# EAGLE design SensorStick_IMUedits_HeaderPins_jesus (EAGLE 9.6.2)
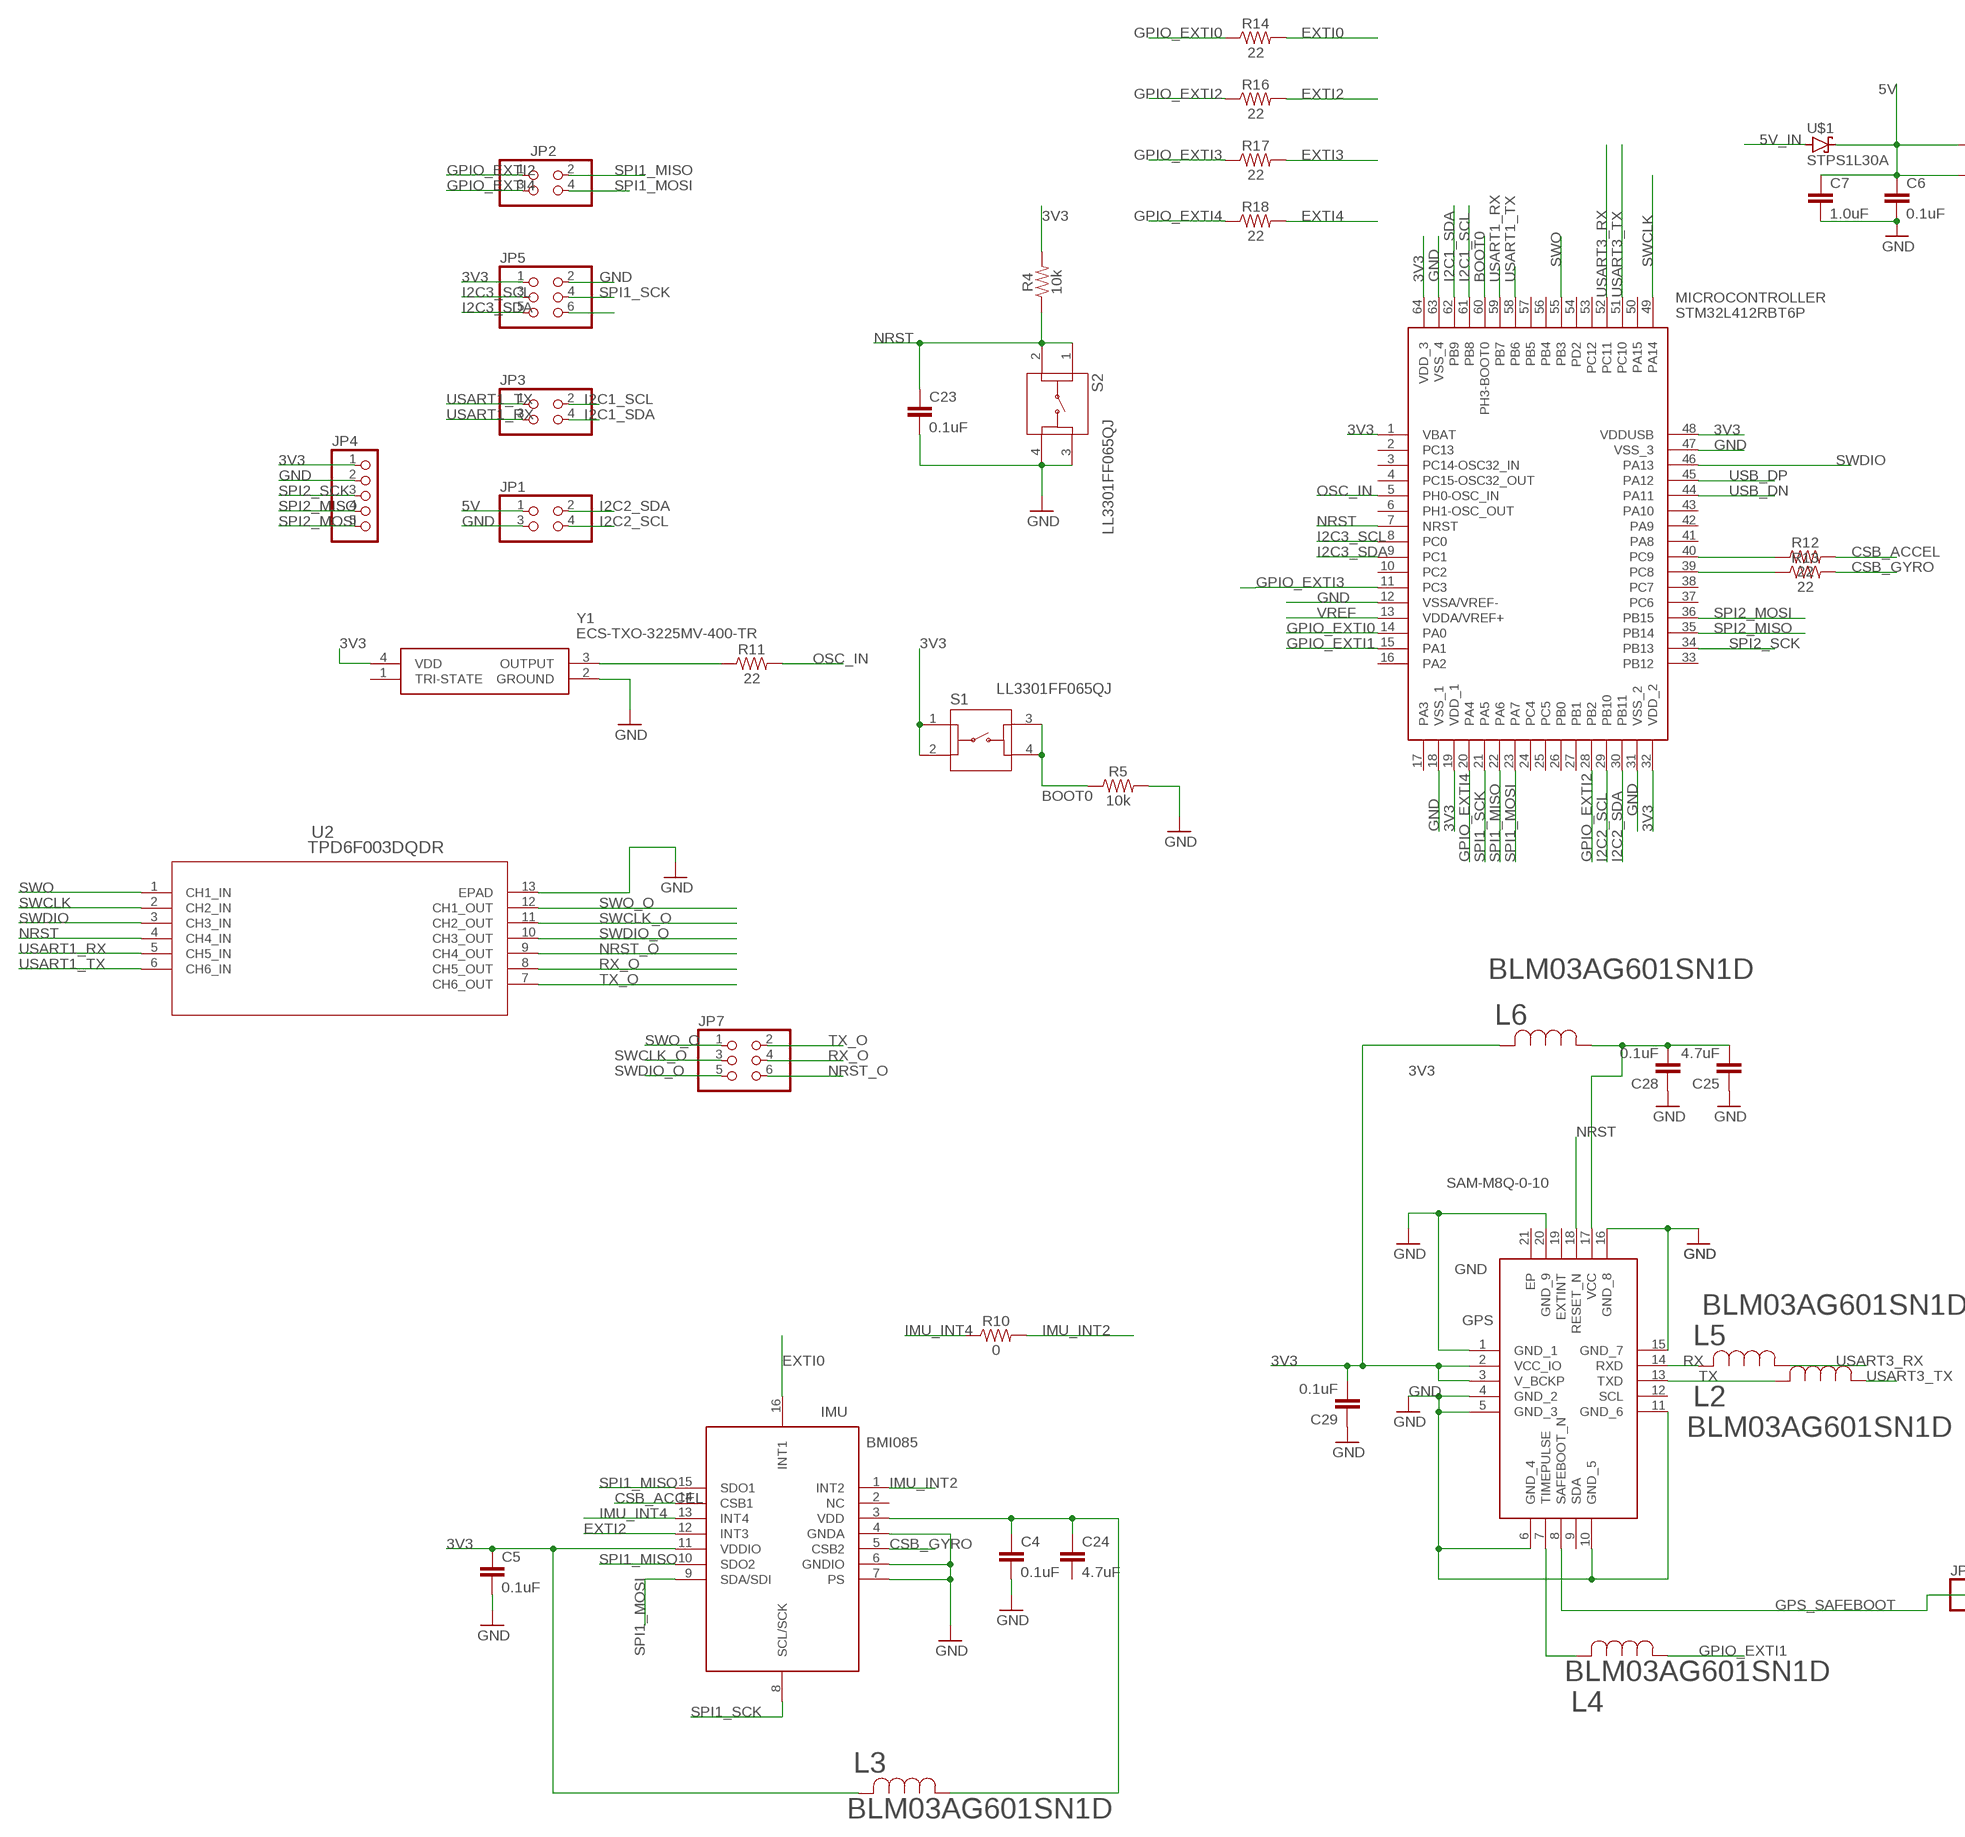
[diagram p0: schematic, sheet 1, part 1 of 2]
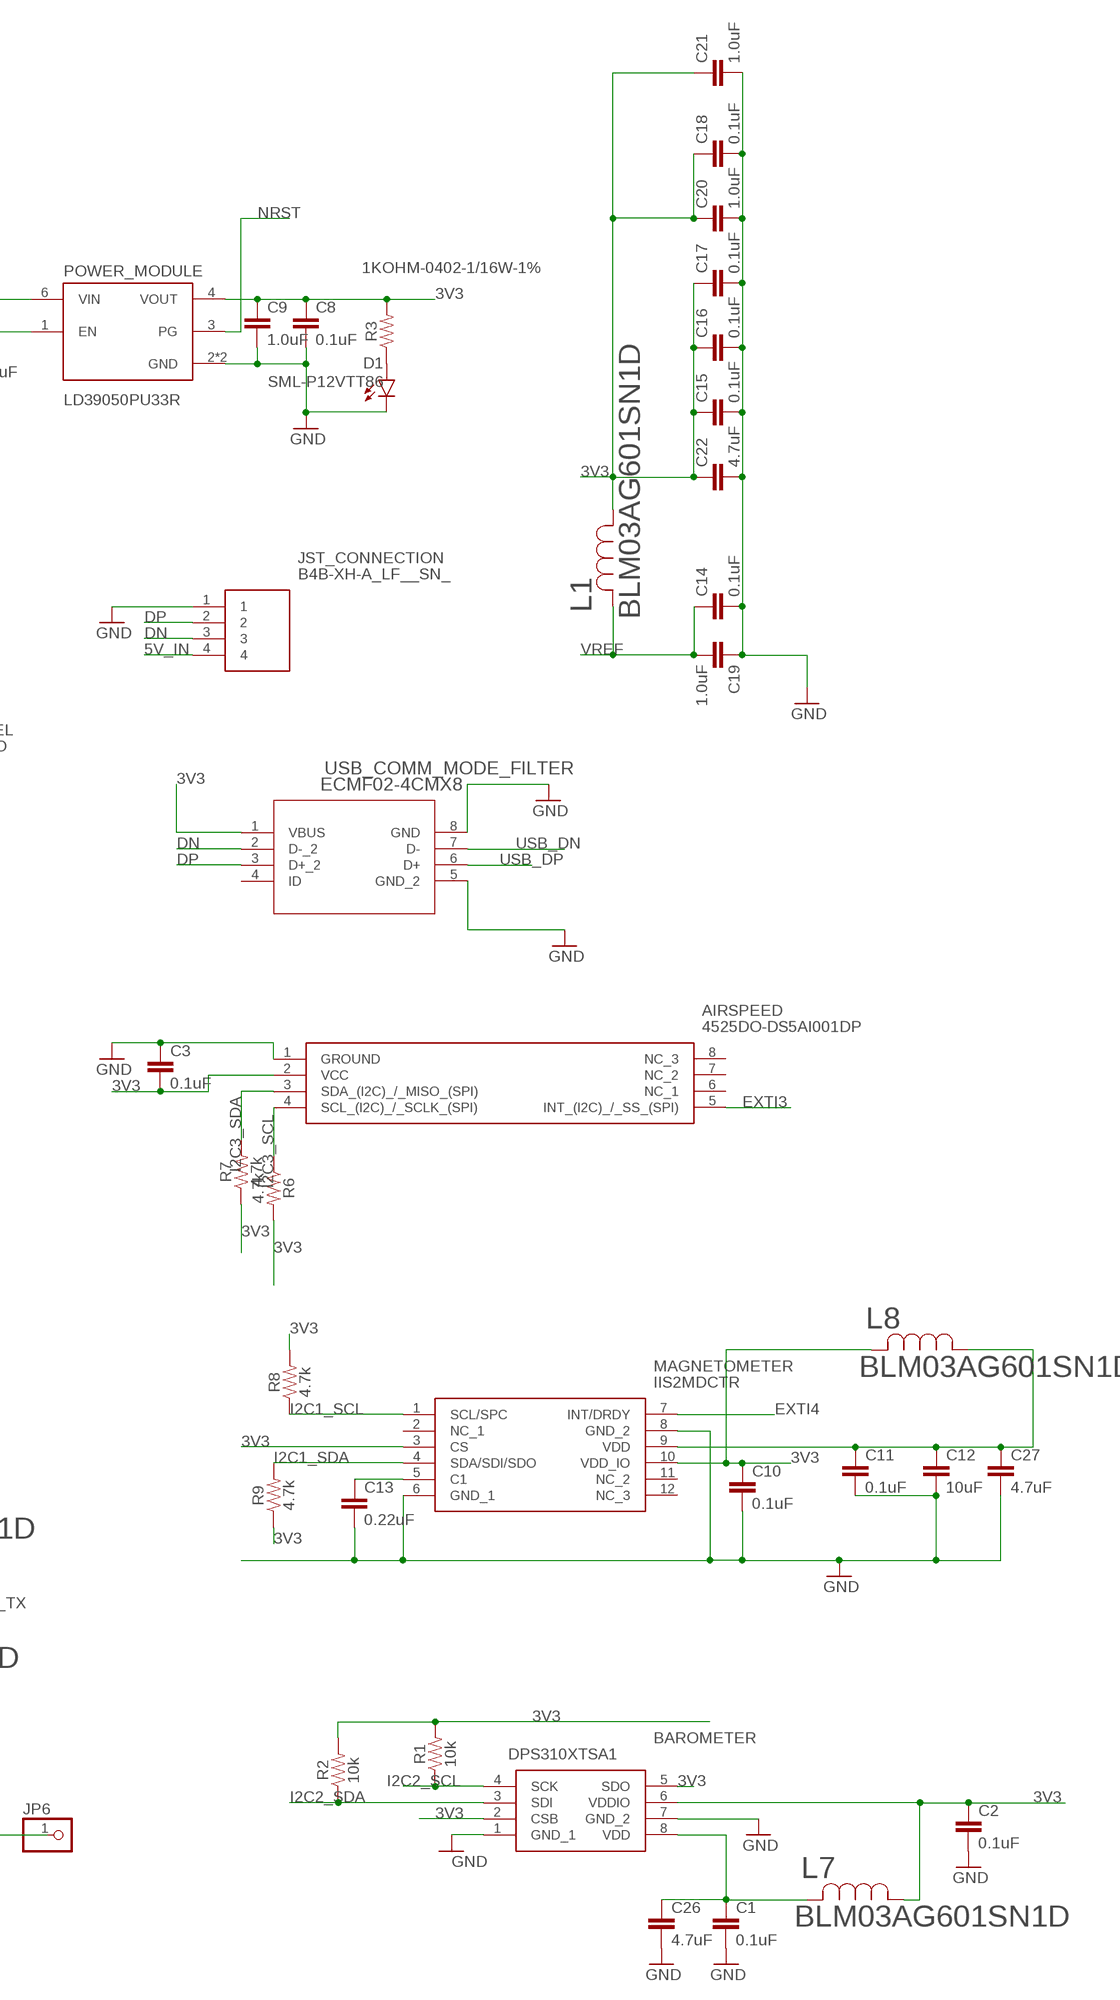
[diagram p1: schematic, sheet 1, part 2 of 2]

## Parts
AIRSPEED  4525DO-DS5AI001DP  [4525DO-DS...P]
BAROMETER  DPS310XTSA1  [DPS310XTSA1]
C1  0.1uF  0.1UF-0402-6.3V-10%-X7R  [0402]
C2  0.1uF  0.1UF-0402-6.3V-10%-X7R  [0402]
C3  0.1uF  0.1UF-0402-6.3V-10%-X7R  [0402]
C4  0.1uF  0.1UF-0402-6.3V-10%-X7R  [0402]
C5  0.1uF  0.1UF-0402-6.3V-10%-X7R  [0402]
C6  0.1uF  0.1UF-0402-6.3V-10%-X7R  [0402]
C7  1.0uF  1.0UF-0402-16V-10%  [0402]
C8  0.1uF  0.1UF-0402-6.3V-10%-X7R  [0402]
C9  1.0uF  1.0UF-0402-16V-10%  [0402]
C10  0.1uF  0.1UF-0402-6.3V-10%-X7R  [0402]
C11  0.1uF  0.1UF-0402-6.3V-10%-X7R  [0402]
C12  10uF  10UF-0603-6.3V-20%  [0603]
C13  0.22uF  0.22UF-0603-25V-10%  [0603]
C14  0.1uF  0.1UF-0603-25V-5%  [0603]
C15  0.1uF  0.1UF-0603-25V-5%  [0603]
C16  0.1uF  0.1UF-0603-25V-5%  [0603]
C17  0.1uF  0.1UF-0603-25V-5%  [0603]
C18  0.1uF  0.1UF-0603-25V-5%  [0603]
C19  1.0uF  1.0UF-0805-25V-10%  [0805]
C20  1.0uF  1.0UF-0805-25V-10%  [0805]
C21  1.0uF  1.0UF-0805-25V-10%  [0805]
C22  4.7uF  4.7UF0603  [0603]
C23  0.1uF  0.1UF-0603-25V-5%  [0603]
C24  4.7uF  4.7UF0603  [0603]
C25  4.7uF  4.7UF0603  [0603]
C26  4.7uF  4.7UF0603  [0603]
C27  4.7uF  4.7UF0603  [0603]
C28  0.1uF  0.1UF-0402-16V-10%  [0402]
C29  0.1uF  0.1UF-0402-16V-10%  [0402]
D1  SML-P12VTT86  [LED_SML-P11UTT86R]
GPS  SAM-M8Q-0-10  [SAMM8Q010]
IMU  BMI085  [BMI085]
JP1  PINHD-2X2  [2X02]
JP2  PINHD-2X2  [2X02]
JP3  PINHD-2X2  [2X02]
JP4  PINHD-1X5  [1X05]
JP5  PINHD-2X3  [2X03]
JP6  PINHD-1X1  [1X01]
JP7  PINHD-2X3  [2X03]
JST_CONNECTION  B4B-XH-A_LF__SN_  [B4BXHALFSN]
L1  BLM03AG601SN1D  [IND_BLM03_0201_MUR]
L2  BLM03AG601SN1D  [IND_BLM03_0201_MUR]
L3  BLM03AG601SN1D  [IND_BLM03_0201_MUR]
L4  BLM03AG601SN1D  [IND_BLM03_0201_MUR]
L5  BLM03AG601SN1D  [IND_BLM03_0201_MUR]
L6  BLM03AG601SN1D  [IND_BLM03_0201_MUR]
L7  BLM03AG601SN1D  [IND_BLM03_0201_MUR]
L8  BLM03AG601SN1D  [IND_BLM03_0201_MUR]
MAGNETOMETER  IIS2MDCTR  [IIS2MDCTR]
MICROCONTROLLER  STM32L412RBT6P  [QFP50P1200X1200X160-64N]
POWER_MODULE  LD39050PU33R  [SON95P300X300X100-7N]
R1  10k  10KOHM-0402-1/16W-1%  [0402]
R2  10k  10KOHM-0402-1/16W-1%  [0402]
R3  1KOHM-0402-1/16W-1%  [0402]
R4  10k  10KOHM-0603-1/10W-1%  [0603]
R5  10k  10KOHM-0603-1/10W-1%  [0603]
R6  4.7k  4.7KOHM-0603-1/10W-1%  [0603]
R7  4.7k  4.7KOHM-0603-1/10W-1%  [0603]
R8  4.7k  4.7KOHM-0603-1/10W-1%  [0603]
R9  4.7k  4.7KOHM-0603-1/10W-1%  [0603]
R10  0  0OHM-0603-1/10W-5%  [0603]
R11  22  22OHM-0402-1/10W-1%  [0402]
R12  22  22OHM-0402-1/10W-1%  [0402]
R13  22  22OHM-0402-1/10W-1%  [0402]
R14  22  22OHM-0402-1/10W-1%  [0402]
R16  22  22OHM-0402-1/10W-1%  [0402]
R17  22  22OHM-0402-1/10W-1%  [0402]
R18  22  22OHM-0402-1/10W-1%  [0402]
S1  LL3301FF065QJ  [LL3301FF065QJ]
S2  LL3301FF065QJ  [LL3301FF065QJ]
U2  TPD6F003DQDR  [DQD12_2X0P4]
U$1  STPS1L30A  [DIOM5226X223N]
USB_COMM_MODE_FILTER  ECMF02-4CMX8  [MICRO_QFN-8L_STM]
Y1  ECS-TXO-3225MV-400-TR  [ECSTXO3225MV400TR]

## Nets
3V3: AIRSPEED.2(VCC) BAROMETER.2(CSB) BAROMETER.5(SDO) BAROMETER.6(VDDIO) C2.1 C3.2 C5.1 C8.1 C9.1 C10.1 C15.1 C16.1 C17.1 C18.1 C20.1 C21.1 C22.1 C29.2 GPS.2(VCC_IO) GPS.3(V_BCKP) IMU.11(VDDIO) JP4.1 JP5.1 L1.1 L3.2 L6.2 L7.1 L8.2 MAGNETOMETER.3(CS) MAGNETOMETER.10(VDD_IO) MICROCONTROLLER.1(VBAT) MICROCONTROLLER.19(VDD_1) MICROCONTROLLER.32(VDD_2) MICROCONTROLLER.48(VDDUSB) MICROCONTROLLER.64(VDD_3) POWER_MODULE.4(VOUT) R1.2 R2.2 R3.2 R4.2 R6.2 R7.1 R8.2 R9.1 S1.1 S1.2 USB_COMM_MODE_FILTER.1(VBUS) Y1.4(VDD)
5V: C6.1 C7.1 JP1.1 POWER_MODULE.1(EN) POWER_MODULE.6(VIN) U$1.1(C)
5V_IN: JST_CONNECTION.4 U$1.2(A)
BOOT0: MICROCONTROLLER.60(PH3-BOOT0) R5.1 S1.3 S1.4
CSB_ACCEL: IMU.14(CSB1) R12.2
CSB_GYRO: IMU.5(CSB2) R13.2
DN: JST_CONNECTION.3 USB_COMM_MODE_FILTER.2(D-_2)
DP: JST_CONNECTION.2 USB_COMM_MODE_FILTER.3(D+_2)
EXTI0: IMU.16(INT1) R14.2
EXTI2: IMU.12(INT3) R16.2
EXTI3: AIRSPEED.5(INT_(I2C)_/_SS_(SPI)) R17.2
EXTI4: MAGNETOMETER.7(INT/DRDY) R18.2
GND: AIRSPEED.1(GROUND) BAROMETER.1(GND_1) BAROMETER.7(GND_2) C1.2 C2.2 C3.1 C4.2 C5.2 C6.2 C7.2 C8.2 C9.2 C10.2 C11.2 C12.2 C13.2 C14.2 C15.2 C16.2 C17.2 C18.2 C19.1 C20.2 C21.2 C22.2 C23.2 C25.1 C26.2 C27.2 C28.1 C29.1 D1.C GPS.1(GND_1) GPS.4(GND_2) GPS.5(GND_3) GPS.6(GND_4) GPS.10(GND_5) GPS.11(GND_6) GPS.15(GND_7) GPS.16(GND_8) GPS.20(GND_9) IMU.4(GNDA) IMU.6(GNDIO) IMU.7(PS) JP1.3 JP4.2 JP5.2 JST_CONNECTION.1 MAGNETOMETER.6(GND_1) MAGNETOMETER.8(GND_2) MICROCONTROLLER.12(VSSA/VREF-) MICROCONTROLLER.18(VSS_1) MICROCONTROLLER.31(VSS_2) MICROCONTROLLER.47(VSS_3) MICROCONTROLLER.63(VSS_4) POWER_MODULE.2(GND) POWER_MODULE.7(GND) R5.2 S2.3 S2.4 U2.13(EPAD) USB_COMM_MODE_FILTER.5(GND_2) USB_COMM_MODE_FILTER.8(GND) Y1.2(GROUND)
GPIO_EXTI0: MICROCONTROLLER.14(PA0) R14.1
GPIO_EXTI1: L4.1 MICROCONTROLLER.15(PA1)
GPIO_EXTI2: JP2.1 MICROCONTROLLER.28(PB2) R16.1
GPIO_EXTI3: MICROCONTROLLER.11(PC3) R17.1
GPIO_EXTI4: JP2.3 MICROCONTROLLER.20(PA4) R18.1
GPS_SAFEBOOT: GPS.8(SAFEBOOT_N) JP6.1
I2C1_SCL: JP3.2 MAGNETOMETER.1(SCL/SPC) MICROCONTROLLER.61(PB8) R8.1
I2C1_SDA: JP3.4 MAGNETOMETER.4(SDA/SDI/SDO) MICROCONTROLLER.62(PB9) R9.2
I2C2_SCL: BAROMETER.4(SCK) JP1.4 MICROCONTROLLER.29(PB10) R1.1
I2C2_SDA: BAROMETER.3(SDI) JP1.2 MICROCONTROLLER.30(PB11) R2.1
I2C3_SCL: AIRSPEED.4(SCL_(I2C)_/_SCLK_(SPI)) JP5.3 MICROCONTROLLER.8(PC0) R6.1
I2C3_SDA: AIRSPEED.3(SDA_(I2C)_/_MISO_(SPI)) JP5.5 MICROCONTROLLER.9(PC1) R7.2
IMU_INT2: IMU.1(INT2) R10.2
IMU_INT4: IMU.13(INT4) R10.1
N$1: R11.1 Y1.3(OUTPUT)
N$2: GPS.7(TIMEPULSE) L4.2
N$3: MICROCONTROLLER.40(PC9) R12.1
N$4: MICROCONTROLLER.39(PC8) R13.1
N$5: D1.A R3.1
N$6: BAROMETER.8(VDD) C1.1 C26.1 L7.2
N$7: C13.1 MAGNETOMETER.5(C1)
N$8: C4.1 C24.1 IMU.3(VDD) L3.1
N$9: C25.2 C28.2 GPS.17(VCC) L6.1
N$10: C11.1 C12.1 C27.1 L8.1 MAGNETOMETER.9(VDD)
N$11: JP5.6
NRST: C23.1 GPS.18(RESET_N) MICROCONTROLLER.7(NRST) POWER_MODULE.3(PG) R4.1 S2.1 S2.2 U2.4(CH4_IN)
NRST_O: JP7.6 U2.9(CH4_OUT)
OSC_IN: MICROCONTROLLER.5(PH0-OSC_IN) R11.2
RX: GPS.14(RXD) L5.2
RX_O: JP7.4 U2.8(CH5_OUT)
SPI1_MISO: IMU.10(SDO2) IMU.15(SDO1) JP2.2 MICROCONTROLLER.22(PA6)
SPI1_MOSI: IMU.9(SDA/SDI) JP2.4 MICROCONTROLLER.23(PA7)
SPI1_SCK: IMU.8(SCL/SCK) JP5.4 MICROCONTROLLER.21(PA5)
SPI2_MISO: JP4.4 MICROCONTROLLER.35(PB14)
SPI2_MOSI: JP4.5 MICROCONTROLLER.36(PB15)
SPI2_SCK: JP4.3 MICROCONTROLLER.34(PB13)
SWCLK: MICROCONTROLLER.49(PA14) U2.2(CH2_IN)
SWCLK_O: JP7.3 U2.11(CH2_OUT)
SWDIO: MICROCONTROLLER.46(PA13) U2.3(CH3_IN)
SWDIO_O: JP7.5 U2.10(CH3_OUT)
SWO: MICROCONTROLLER.55(PB3) U2.1(CH1_IN)
SWO_O: JP7.1 U2.12(CH1_OUT)
TX: GPS.13(TXD) L2.2
TX_O: JP7.2 U2.7(CH6_OUT)
USART1_RX: JP3.3 MICROCONTROLLER.59(PB7) U2.5(CH5_IN)
USART1_TX: JP3.1 MICROCONTROLLER.58(PB6) U2.6(CH6_IN)
USART3_RX: L5.1 MICROCONTROLLER.52(PC11)
USART3_TX: L2.1 MICROCONTROLLER.51(PC10)
USB_DN: MICROCONTROLLER.44(PA11) USB_COMM_MODE_FILTER.7(D-)
USB_DP: MICROCONTROLLER.45(PA12) USB_COMM_MODE_FILTER.6(D+)
VREF: C14.1 C19.2 L1.2 MICROCONTROLLER.13(VDDA/VREF+)
Unconnected: AIRSPEED.6(NC_1) AIRSPEED.7(NC_2) AIRSPEED.8(NC_3) C24.2 GPS.9(SDA) GPS.12(SCL) GPS.19(EXTINT) GPS.21(EP) IMU.2(NC) MAGNETOMETER.2(NC_1) MAGNETOMETER.11(NC_2) MAGNETOMETER.12(NC_3) MICROCONTROLLER.2(PC13) MICROCONTROLLER.3(PC14-OSC32_IN) MICROCONTROLLER.4(PC15-OSC32_OUT) MICROCONTROLLER.6(PH1-OSC_OUT) MICROCONTROLLER.10(PC2) MICROCONTROLLER.16(PA2) MICROCONTROLLER.17(PA3) MICROCONTROLLER.24(PC4) MICROCONTROLLER.25(PC5) MICROCONTROLLER.26(PB0) MICROCONTROLLER.27(PB1) MICROCONTROLLER.33(PB12) MICROCONTROLLER.37(PC6) MICROCONTROLLER.38(PC7) MICROCONTROLLER.41(PA8) MICROCONTROLLER.42(PA9) MICROCONTROLLER.43(PA10) MICROCONTROLLER.50(PA15) MICROCONTROLLER.53(PC12) MICROCONTROLLER.54(PD2) MICROCONTROLLER.56(PB4) MICROCONTROLLER.57(PB5) USB_COMM_MODE_FILTER.4(ID) Y1.1(TRI-STATE)

## Library data of the parts
AIRSPEED = 4525DO-DS5AI001DP:4525DO-DS5AI001DP: Differential Pressure Sensor 1PSI Dual Barbs Source: Datasheet <http://www.te.com/commerce/DocumentDelivery/DDEController?Action=srchrtrv&DocNm=MS4525DO&DocType=DS&DocLang=English>; ARROW_PART_NUMBER: 4525DO-DS5AI001DP; ARROW_PRICE-STOCK: https://www.arrow.com/en/products/4525do-ds5ai001dp/te-connectivity; DESCRIPTION: Differential Pressure Sensor 1PSI Dual Barbs; HEIGHT: mm; MANUFACTURER_NAME: TE Connectivity; MANUFACTURER_PART_NUMBER: 4525DO-DS5AI001DP; MOUSER_PART_NUMBER: 824-4525DODS5AI001DP; MOUSER_PRICE-STOCK: https://www.mouser.co.uk/ProductDetail/Measurement-Specialties/4525DO-DS5AI001DP?qs=oFx6pF86PmDUpUCTX7loEA%3D%3D
BAROMETER = DPS310XTSA1:DPS310XTSA1: INFINEON - DPS310XTSA1 - DIGITAL PRESSURE SENSOR, 1200HPA, VLGA-8 Source: Datasheet <https://www.infineon.com/dgdl/Infineon-DPS310-DS-v01_00-EN.pdf?fileId=5546d462576f34750157750826c42242>; ARROW_PART_NUMBER: DPS310XTSA1; ARROW_PRICE-STOCK: https://www.arrow.com/en/products/dps310xtsa1/infineon-technologies-ag?region=nac; DESCRIPTION: INFINEON - DPS310XTSA1 - DIGITAL PRESSURE SENSOR, 1200HPA, VLGA-8; HEIGHT: 1.01mm; MANUFACTURER_NAME: Infineon; MANUFACTURER_PART_NUMBER: DPS310XTSA1; MOUSER_PART_NUMBER: 726-DPS310XTSA1; MOUSER_PRICE-STOCK: https://www.mouser.co.uk/ProductDetail/Infineon-Technologies/DPS310XTSA1?qs=uuTTuBTXn66Ynca8WHwycg%3D%3D
C1 C2 C4-C6 C8 C10 C11 = SparkFun-Capacitors:0.1UF: 0.1µF ceramic capacitors A capacitor is a passive two-terminal electrical component used to store electrical energy temporarily in an electric field.; PROD_ID: CAP-14993
C3 = SparkFun-Capacitors:0.1UF: 0.1µF ceramic capacitors A capacitor is a passive two-terminal electrical component used to store electrical energy temporarily in an electric field.; PROD_ID: CAP-14993; SPICEPREFIX: C
C7 C9 = SparkFun-Capacitors:1.0UF: 1µF ceramic capacitors A capacitor is a passive two-terminal electrical component used to store electrical energy temporarily in an electric field.; PROD_ID: CAP-12417
C12 = SparkFun-Capacitors:10UF: 10.0µF ceramic capacitors A capacitor is a passive two-terminal electrical component used to store electrical energy temporarily in an electric field.; PROD_ID: CAP-11015
C13 = SparkFun-Capacitors:0.22UF: 0.22µF ceramic capacitors A capacitor is a passive two-terminal electrical component used to store electrical energy temporarily in an electric field.; PROD_ID: CAP-07822
C14-C18 C23 = SparkFun-Capacitors:0.1UF: 0.1µF ceramic capacitors A capacitor is a passive two-terminal electrical component used to store electrical energy temporarily in an electric field.; PROD_ID: CAP-08604
C19-C21 = SparkFun-Capacitors:1.0UF: 1µF ceramic capacitors A capacitor is a passive two-terminal electrical component used to store electrical energy temporarily in an electric field.; PROD_ID: CAP-08064
C22 C24-C27 = SparkFun-Capacitors:4.7UF: 4.7µF ceramic capacitors A capacitor is a passive two-terminal electrical component used to store electrical energy temporarily in an electric field.; PROD_ID: CAP-08280
C28 C29 = SparkFun-Capacitors:0.1UF: 0.1µF ceramic capacitors A capacitor is a passive two-terminal electrical component used to store electrical energy temporarily in an electric field.; PROD_ID: CAP-12416
D1 = ce-capstone:SML-P12VTT86: SML-P1 Series Red 0402 Clear 60 mcd 2 V Surface Mount PICOLED LED; AVAILABILITY: Unavailable; DESCRIPTION: Red 630nm LED Indication - Discrete 2V 0402 _1006 Metric_; MF: Rohm; MP: SML-P12VTT86; PACKAGE: 0402 Rohm; PRICE: None
GPS = SAM-M8Q-0-10:SAM-M8Q-0-10: GNSS antenna module Source: Datasheet <https://www.u-blox.com/sites/default/files/SAM-M8Q_DataSheet_(UBX-16012619).pdf>; DESCRIPTION: GNSS antenna module; HEIGHT: 3mm; MANUFACTURER_NAME: U-Blox; MANUFACTURER_PART_NUMBER: SAM-M8Q-0-10; MOUSER_PART_NUMBER: N/A; MOUSER_PRICE-STOCK: https://www.mouser.co.uk/ProductDetail/u-blox/SAM-M8Q-0-10?qs=KUoIvG%2F9IlYKGQbFkOKljQ%3D%3D
IMU = BMI085:BMI085: IMUs - Inertial Measurement Units High-performance IMU BMI085 for virtual and augmented reality applications Source: Datasheet <https://ae-bst.resource.bosch.com/media/_tech/media/datasheets/BST-BMI085-DS001.pdf>; ARROW_PART_NUMBER: BMI085; ARROW_PRICE-STOCK: https://www.arrow.com/en/products/bmi085/bosch; DESCRIPTION: IMUs - Inertial Measurement Units High-performance IMU BMI085 for virtual and augmented reality applications; HEIGHT: 1mm; MANUFACTURER_NAME: Bosch Sensortec; MANUFACTURER_PART_NUMBER: BMI085; MOUSER_PART_NUMBER: 262-BMI085; MOUSER_PRICE-STOCK: https://www.mouser.co.uk/ProductDetail/Bosch-Sensortec/BMI085?qs=y6ZabgHbY%252ByGCM8LfWZyqA%3D%3D
JP1-JP3 = pinhead:PINHD-2X2: PIN HEADER
JP4 = pinhead:PINHD-1X5: PIN HEADER
JP5 JP7 = pinhead:PINHD-2X3: PIN HEADER
JP6 = pinhead:PINHD-1X1: PIN HEADER
JST_CONNECTION = B4B-XH-A_LF__SN_:B4B-XH-A_LF__SN_: CONN HEADER VERT 4POS 2.5MM Source: Datasheet <https://datasheet.lcsc.com/szlcsc/JST-Sales-America-B4B-XH-A-LF-SN_C144395.pdf>; ARROW_PART_NUMBER: B4B-XH-A(LF)(SN); ARROW_PRICE-STOCK: https://www.arrow.com/en/products/b4b-xh-a-lf-sn/jst-manufacturing?region=europe; DESCRIPTION: CONN HEADER VERT 4POS 2.5MM; HEIGHT: 7mm; MANUFACTURER_NAME: JST (JAPAN SOLDERLESS TERMINALS); MANUFACTURER_PART_NUMBER: B4B-XH-A(LF)(SN)
L1-L8 = BLM03AG601SN1D:BLM03AG601SN1D; COPYRIGHT: Copyright (C) 2023 Ultra Librarian. All rights reserved.; DIGI-KEY_PART_NUMBER_1: 490-5164-1-ND; DIGI-KEY_PART_NUMBER_2: 490-5164-2-ND; DIGI-KEY_PART_NUMBER_3: 490-5164-6-ND; MANUFACTURER_PART_NUMBER: BLM03AG601SN1D; MFR_NAME: Murata
MAGNETOMETER = IIS2MDCTR:IIS2MDCTR: STMICROELECTRONICS - IIS2MDCTR - MEMS MODULE, 3-AXIS MAGNETOMETER, LGA-12 Source: Datasheet <https://www.st.com/resource/en/datasheet/iis2mdc.pdf>; ARROW_PART_NUMBER: IIS2MDCTR; ARROW_PRICE-STOCK: https://www.arrow.com/en/products/iis2mdctr/stmicroelectronics; DESCRIPTION: STMICROELECTRONICS - IIS2MDCTR - MEMS MODULE, 3-AXIS MAGNETOMETER, LGA-12; HEIGHT: 0.7mm; MANUFACTURER_NAME: STMicroelectronics; MANUFACTURER_PART_NUMBER: IIS2MDCTR; MOUSER_PART_NUMBER: 511-IIS2MDCTR; MOUSER_PRICE-STOCK: https://www.mouser.co.uk/ProductDetail/STMicroelectronics/IIS2MDCTR?qs=1mbolxNpo8ems1K%2FRdQzXg%3D%3D
MICROCONTROLLER = STM32L412RBT6P:STM32L412RBT6P: ARM Microcontrollers - MCU Source: Datasheet <https://www.st.com/resource/en/datasheet/stm32l412c8.pdf>; DESCRIPTION: ARM Microcontrollers - MCU; HEIGHT: 1.6mm; MANUFACTURER_NAME: STMicroelectronics; MANUFACTURER_PART_NUMBER: STM32L412RBT6P; MOUSER_PART_NUMBER: 511-STM32L412RBT6P; MOUSER_PRICE-STOCK: https://www.mouser.co.uk/ProductDetail/STMicroelectronics/STM32L412RBT6P?qs=l7cgNqFNU1hh%252BU1wOZs5Xg%3D%3D
POWER_MODULE = ce-capstone:LD39050PU33R: LD39050 Series 500 mA 3.3 V Fixed Low Noise LDO Voltage Regulator - DFN-6; AVAILABILITY: Unavailable; DESCRIPTION: Linear Voltage Regulator IC 1 Output 500mA 6-DFN _3x3_; MF: STMicroelectronics; MP: LD39050PU33R; PACKAGE: DFN-6 STMicroelectronics; PRICE: None
R1 R2 = SparkFun-Resistors:10KOHM: 10kΩ resistor A resistor is a passive two-terminal electrical component that implements electrical resistance as a circuit element. Resistors act to reduce current flow, and, at the same time, act to lower voltage levels within circuits. - Wikipedia; PROD_ID: RES-14241
R3 = SparkFun-Resistors:1KOHM: 1kΩ resistor A resistor is a passive two-terminal electrical component that implements electrical resistance as a circuit element. Resistors act to reduce current flow, and, at the same time, act to lower voltage levels within circuits. - Wikipedia; PROD_ID: RES-14342
R4 R5 = SparkFun-Resistors:10KOHM: 10kΩ resistor A resistor is a passive two-terminal electrical component that implements electrical resistance as a circuit element. Resistors act to reduce current flow, and, at the same time, act to lower voltage levels within circuits. - Wikipedia; PROD_ID: RES-00824
R6-R9 = SparkFun-Resistors:4.7KOHM: 4.7kΩ resistor A resistor is a passive two-terminal electrical component that implements electrical resistance as a circuit element. Resistors act to reduce current flow, and, at the same time, act to lower voltage levels within circuits. - Wikipedia; PROD_ID: RES-07857
R10 = SparkFun-Resistors:0OHM: 0Ω resistor A resistor is a passive two-terminal electrical component that implements electrical resistance as a circuit element. Resistors act to reduce current flow, and, at the same time, act to lower voltage levels within circuits. - Wikipedia; PROD_ID: RES-08609
R11-R14 R16-R18 = SparkFun-Resistors:22OHM: 22Ω resistor A resistor is a passive two-terminal electrical component that implements electrical resistance as a circuit element. Resistors act to reduce current flow, and, at the same time, act to lower voltage levels within circuits. - Wikipedia; PROD_ID: RES-12427
S1 S2 = ce-capstone:LL3301FF065QJ: Pushbutton Switches 50mA 12VDC F065 7.0mm J-Lead Source: Datasheet <https://componentsearchengine.com/Datasheets/1/LL3301FF065QJ.pdf>; DESCRIPTION: Pushbutton Switches 50mA 12VDC F065 7.0mm J-Lead; HEIGHT: 7.3mm; MANUFACTURER_NAME: E-Switch; MANUFACTURER_PART_NUMBER: LL3301FF065QJ; MOUSER_PART_NUMBER: 612-LL3301FF065QJ; MOUSER_PRICE-STOCK: https://www.mouser.com/Search/Refine.aspx?Keyword=612-LL3301FF065QJ
U2 = TPD6F003DQDR:TPD6F003DQDR; COPYRIGHT: Copyright (C) 2023 Ultra Librarian. All rights reserved.; DIGI-KEY_PART_NUMBER_1: 296-25802-1-ND; DIGI-KEY_PART_NUMBER_2: 296-25802-2-ND; DIGI-KEY_PART_NUMBER_3: 296-25802-6-ND; DIGI-KEY_PART_NUMBER_4: 2156-TPD6F003DQDR-ND; MANUFACTURER_PART_NUMBER: TPD6F003DQDR; MFR_NAME: Texas Instruments
U$1 = ce-capstone:STPS1L30A
USB_COMM_MODE_FILTER = ECMF02-4CMX8:ECMF02-4CMX8; COPYRIGHT: Copyright (C) 2023 Ultra Librarian. All rights reserved.; DIGI-KEY_PART_NUMBER_1: 497-13420-2-ND; DIGI-KEY_PART_NUMBER_2: 497-13420-1-ND; DIGI-KEY_PART_NUMBER_3: 497-13420-6-ND; MANUFACTURER_PART_NUMBER: ECMF02-4CMX8; MFR_NAME: STMicroelectronics
Y1 = SamacSys_Parts:ECS-TXO-3225MV-400-TR: TCXO Oscillators 40.000 MHZ Multi-Volt +1.7 3.6V HCMOS TCXO +/-2.5 ppm -30 +85 C 3.2x 2.5mm RoHS Source: Datasheet <https://ecsxtal.com/store/pdf/ECS-TXO-3225MV.pdf>; DESCRIPTION: TCXO Oscillators 40.000 MHZ Multi-Volt +1.7 3.6V HCMOS TCXO +/-2.5 ppm -30 +85 C 3.2x 2.5mm RoHS; HEIGHT: 1.2mm; MANUFACTURER_NAME: ECS; MANUFACTURER_PART_NUMBER: ECS-TXO-3225MV-400-TR

## Board
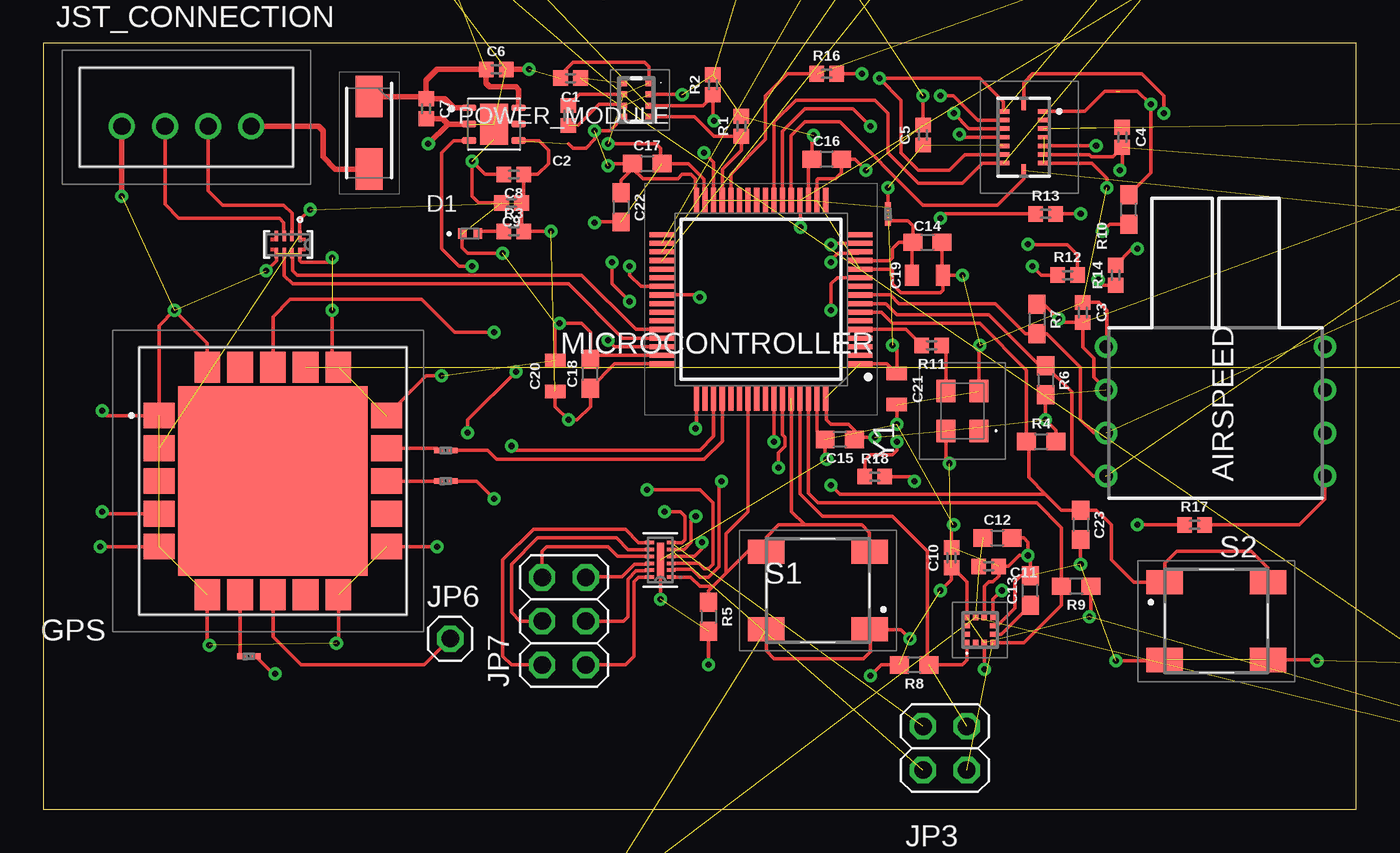
[diagram p2: board, top side]
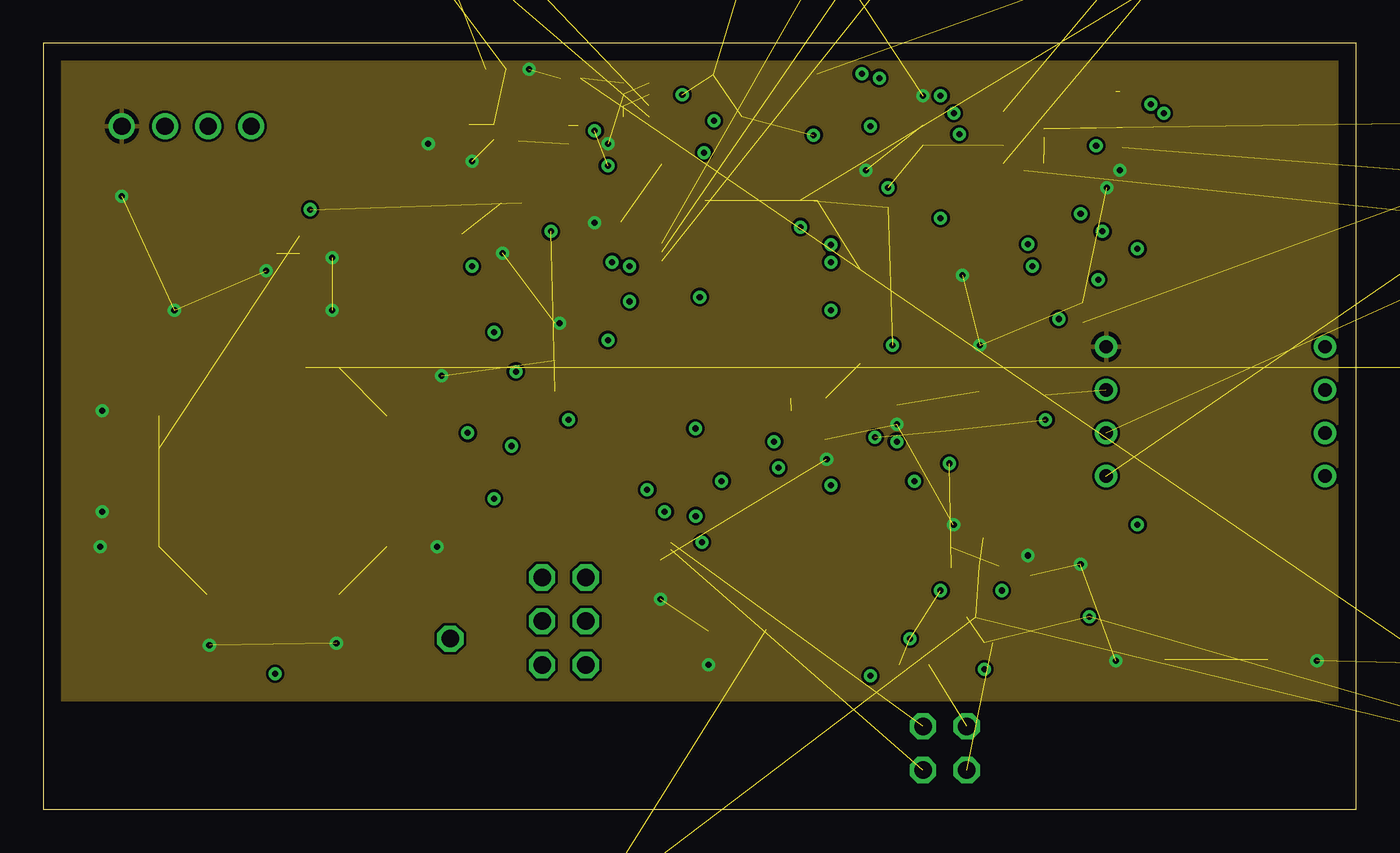
[diagram p3: board, inner layer Route2]
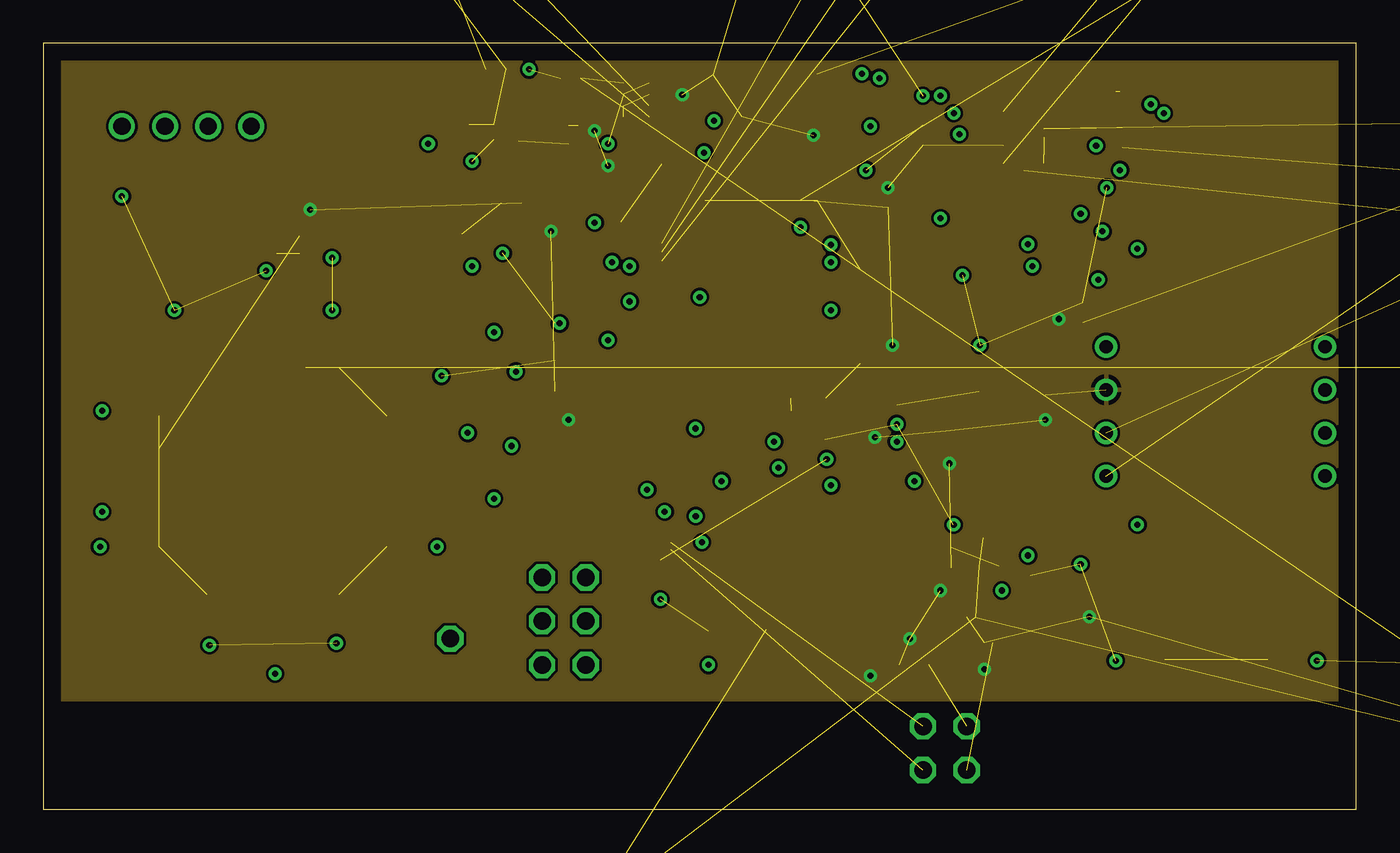
[diagram p4: board, inner layer Route15]
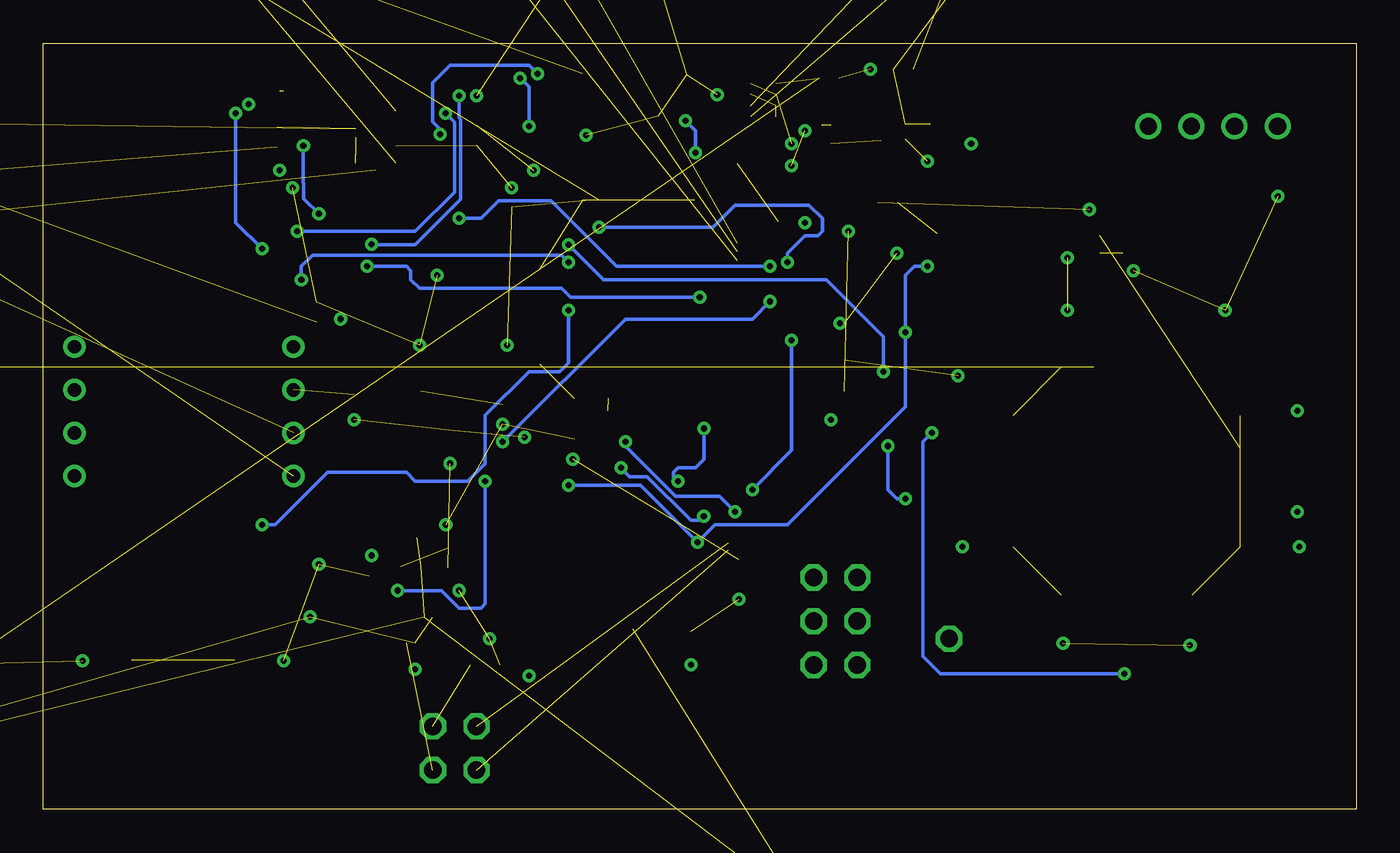
[diagram p5: board, bottom side, seen from below]

Size 76.2 x 44.45 mm. Coordinates in mm from the lower left corner, seen from the top.
Outline: 0,0 76.2,0 76.2,44.45 0,44.45 0,0
Copper layers (1+2*15+16): Top 0.035mm / dielectric 1.5mm / Route2 0.035mm / dielectric 0.15mm / Route15 0.035mm / dielectric 0.2mm / Bottom 0.035mm
Design rules "default *": minimum track width 8mil, minimum drill 0.35mm, track to track 6mil, track to pad 6mil, pad to pad 6mil, via to via 6mil, smd to smd 6mil, copper to edge 40mil, drill to drill 6mil, minimum pad ring 10mil, minimum via ring 8mil, stop-mask expansion 4mil, vias tented up to drill 0mil, thermal gap 10mil

### Footprints (pad centres in the part's own frame; a part is rotated, then mirrored left to right if it is on the bottom)
4525DO-DS...P = drill 0.78 pad 1.28: 1 1.1,-8.3; 2 3.6,-8.3; 3 6.1,-8.3; 4 8.6,-8.3; 5 8.6,4.4; 6 6.1,4.4; 7 3.6,4.4; 8 1.1,4.4
DPS310XTSA1 = smd 0.35 x 0.35: 1 0.975,-0.725; 2 0.325,-0.725; 3 -0.325,-0.725; 4 -0.975,-0.725; 5 -0.975,0.725; 6 -0.325,0.725; 7 0.325,0.725; 8 0.975,0.725
0402 = smd 0.85 x 0.9: 1 -0.58,0; 2 0.58,0
0603 = smd 1.1 x 1: 1 -0.85,0; 2 0.85,0
0805 = smd 0.8 x 1.2: 1 -0.9,0; 2 0.9,0
LED_SML-P11UTT86R = smd 0.5 x 0.6: A 0.45,0; C -0.45,0
SAMM8Q010 = smd 1.8 x 1.5: 1 -6.6,3.8; 2 -6.6,1.9; 3 -6.6,0; 4 -6.6,-1.9; 5 -6.6,-3.8; 11 6.6,-3.8; 12 6.6,-1.9; 13 6.6,0; 14 6.6,1.9; 15 6.6,3.8 | smd 1.5 x 1.8: 6 -3.8,-6.6; 7 -1.9,-6.6; 8 0,-6.6; 9 1.9,-6.6; 10 3.8,-6.6; 16 3.8,6.6; 17 1.9,6.6; 18 0,6.6; 19 -1.9,6.6; 20 -3.8,6.6 | smd 11 x 11: 21 0,0
BMI085 = smd 0.675 x 0.25: 1 1.165,1.5; 2 1.165,1; 3 1.165,0.5; 4 1.165,0; 5 1.165,-0.5; 6 1.165,-1; 7 1.165,-1.5; 9 -1.165,-1.5; 10 -1.165,-1; 11 -1.165,-0.5; 12 -1.165,0; 13 -1.165,0.5; 14 -1.165,1; 15 -1.165,1.5 | smd 0.25 x 0.675: 8 0,-1.915; 16 0,1.915
2X02 = drill 1.016 octagon: 1 -1.27,-1.27; 2 -1.27,1.27; 3 1.27,-1.27; 4 1.27,1.27
1X05 = drill 1.016 long: 1 -5.08,0; 2 -2.54,0; 3 0,0; 4 2.54,0; 5 5.08,0
2X03 = drill 1.016 octagon: 1 -2.54,-1.27; 2 -2.54,1.27; 3 0,-1.27; 4 0,1.27; 5 2.54,-1.27; 6 2.54,1.27
1X01 = drill 1.016 octagon: 1 0,0
B4BXHALFSN = drill 1 pad 1.5: 1 0,0; 2 2.5,0; 3 5,0; 4 7.5,0
IND_BLM03_0201_MUR = smd 0.559 x 0.33: 1 -0.394,0; 2 0.394,0
IIS2MDCTR = smd 0.35 x 0.3: 1 -0.75,0.75; 2 -0.75,0.25; 3 -0.75,-0.25; 4 -0.75,-0.75; 7 0.75,-0.75; 8 0.75,-0.25; 9 0.75,0.25; 10 0.75,0.75 | smd 0.3 x 0.35: 5 -0.25,-0.75; 6 0.25,-0.75; 11 0.25,0.75; 12 -0.25,0.75
QFP50P1200X1200X160-64N = smd 1.475 x 0.3: 1 -5.738,3.75; 2 -5.738,3.25; 3 -5.738,2.75; 4 -5.738,2.25; 5 -5.738,1.75; 6 -5.738,1.25; 7 -5.738,0.75; 8 -5.738,0.25; 9 -5.738,-0.25; 10 -5.738,-0.75; 11 -5.738,-1.25; 12 -5.738,-1.75; 13 -5.738,-2.25; 14 -5.738,-2.75; 15 -5.738,-3.25; 16 -5.738,-3.75; 33 5.738,-3.75; 34 5.738,-3.25; 35 5.738,-2.75; 36 5.738,-2.25; 37 5.738,-1.75; 38 5.738,-1.25; 39 5.738,-0.75; 40 5.738,-0.25; 41 5.738,0.25; 42 5.738,0.75; 43 5.738,1.25; 44 5.738,1.75; 45 5.738,2.25; 46 5.738,2.75; 47 5.738,3.25; 48 5.738,3.75 | smd 0.3 x 1.475: 17 -3.75,-5.738; 18 -3.25,-5.738; 19 -2.75,-5.738; 20 -2.25,-5.738; 21 -1.75,-5.738; 22 -1.25,-5.738; 23 -0.75,-5.738; 24 -0.25,-5.738; 25 0.25,-5.738; 26 0.75,-5.738; 27 1.25,-5.738; 28 1.75,-5.738; 29 2.25,-5.738; 30 2.75,-5.738; 31 3.25,-5.738; 32 3.75,-5.738; 49 3.75,5.738; 50 3.25,5.738; 51 2.75,5.738; 52 2.25,5.738; 53 1.75,5.738; 54 1.25,5.738; 55 0.75,5.738; 56 0.25,5.738; 57 -0.25,5.738; 58 -0.75,5.738; 59 -1.25,5.738; 60 -1.75,5.738; 61 -2.25,5.738; 62 -2.75,5.738; 63 -3.25,5.738; 64 -3.75,5.738
SON95P300X300X100-7N = smd 0.84 x 0.4: 1 -1.435,0.95; 2 -1.435,0; 3 -1.435,-0.95; 4 1.435,-0.95; 5 1.435,0; 6 1.435,0.95 | smd 1.625 x 2.365: 7 0,0
LL3301FF065QJ = smd 2.1 x 1.4: 1 -3,2.25; 2 3,2.25; 3 -3,-2.25; 4 3,-2.25
DQD12_2X0P4 = smd 0.5 x 0.2: 1 -0.625,1; 2 -0.625,0.6; 3 -0.625,0.2; 4 -0.625,-0.2; 5 -0.625,-0.6; 6 -0.625,-1; 7 0.625,-1; 8 0.625,-0.6; 9 0.625,-0.2; 10 0.625,0.2; 11 0.625,0.6; 12 0.625,1 | smd 0.4 x 2: 13 0,0
DIOM5226X223N = smd 2.4 x 1.55: 1 -2.1,0; 2 2.1,0
MICRO_QFN-8L_STM = smd 0.61 x 0.203: 1 -0.5,0.675; 2 -0.5,0.225; 3 -0.5,-0.225; 4 -0.5,-0.675; 5 0.5,-0.675; 6 0.5,-0.225; 7 0.5,0.225; 8 0.5,0.675
ECSTXO3225MV400TR = smd 1.3 x 1.1: 1 -1.15,-0.95; 2 1.15,-0.95; 3 1.15,0.95; 4 -1.15,0.95

### Placement (x,y rotation side)
AIRSPEED  69.98,27.94 270 top
BAROMETER  34.42,41.15 90 top
C1  30.61,42.42 180 top
C2  30.48,40.26 90 top
C3  60.33,28.83 270 top
C4  62.61,38.99 270 top
C5  51.05,39.12 90 top
C6  26.29,42.93 0 top
C7  22.23,40.64 270 top
C8  27.3,36.83 180 top
C9  27.18,35.18 180 top
C10  52.7,14.61 90 top
C11  54.86,14.1 0 top
C12  55.37,15.75 0 top
C13  57.28,12.7 90 top
C14  51.31,32.89 0 top
C15  46.23,21.46 180 top
C16  45.47,37.72 0 top
C17  35.05,37.46 0 top
C18  31.75,25.27 90 top
C19  51.31,30.99 180 top
C20  29.72,25.15 90 top
C21  49.53,24.38 270 top
C22  33.53,34.92 270 top
C23  60.2,16.51 270 top
C24  94.23,11.43 0 top  (outside the outline)
C25  94.23,8.13 0 top  (outside the outline)
C26  94.23,4.83 0 top  (outside the outline)
C27  94.23,1.52 0 top  (outside the outline)
C28  94.23,-1.78 0 top  (outside the outline)
C29  94.23,-5.08 0 top  (outside the outline)
D1  24.77,33.4 0 top
GPS  13.34,19.05 0 top
IMU  56.9,38.99 0 top
JP1  23.62,50.29 270 top  (outside the outline)
JP2  67.31,51.56 0 top  (outside the outline)
JP3  52.32,3.56 270 top
JP4  46.74,51.82 0 top  (outside the outline)
JP5  84.33,34.04 270 top  (outside the outline)
JP6  23.62,9.91 0 top
JP7  30.23,10.92 90 top
JST_CONNECTION  4.57,39.62 0 top
L1  49.02,34.54 270 top
L2  23.37,19.05 180 top
L3  123.95,40.39 0 top  (outside the outline)
L4  11.94,8.89 180 top
L5  23.37,20.83 180 top
L6  123.95,25.65 0 top  (outside the outline)
L7  87.63,3.56 0 top  (outside the outline)
L8  30.73,-6.86 0 top  (outside the outline)
MAGNETOMETER  54.36,10.41 90 top
MICROCONTROLLER  41.66,29.59 180 top
POWER_MODULE  26.16,39.75 0 top
R1  40.51,39.62 90 top
R2  38.86,42.04 90 top
R3  27.3,33.53 0 top
R4  57.91,21.34 0 top
R5  38.61,11.18 270 top
R6  58.17,24.89 270 top
R7  57.66,28.45 270 top
R8  50.55,8.38 180 top
R9  59.94,12.95 180 top
R10  62.99,34.8 90 top
R11  51.56,26.92 180 top
R12  59.44,30.99 0 top
R13  58.17,34.54 0 top
R14  62.23,30.99 90 top
R16  45.47,42.67 0 top
R17  66.8,16.51 0 top
R18  48.26,19.3 0 top
S1  44.96,12.7 180 top
S2  68.07,10.92 0 top
U2  35.81,14.48 180 top
U$1  18.92,39.24 270 top
USB_COMM_MODE_FILTER  14.22,32.77 270 top
Y1  53.34,23.11 90 top

### Tracks (layer width: path | path; a pad name or v marks a point on that pad's centre or on a via)
3V3  (via drill 0.35)  (32 unrouted)
  Top 0.203: MICROCONTROLLER.48 33.17,25.84 C18.1 31.75,23.37 30.99,22.61 v30.48,22.61 29.72,23.37 C20.1 | MICROCONTROLLER.1 48.97,25.84 C21.1 49.53,26.67 v49.28,26.92 | MICROCONTROLLER.19 44.41,37.51 C16.1 44.62,39.03 v44.7,39.12 | MICROCONTROLLER.32 37.85,35.39 37.85,36.57 37.59,36.83 37.08,36.83 36.83,36.58 34.8,36.58 34.2,37.17 | 34.2,37.17 C17.1 32.89,37.46 v32.77,37.34 | C22.1 33.53,36.5 34.2,37.17 | v29.46,33.53 R3.2 27.76,33.66 C9.1 27.89,35.31 C8.1 28.7,36.83 29.34,37.46 29.34,38.23 28.76,38.8 POWER_MODULE.4 | MICROCONTROLLER.64 45.47,23.79 45.47,22.61 45.72,22.35 46.74,22.35 47.08,22.01 C15.1 47.2,21.59 v48.26,21.59 | L1.1 v49.02,36.07 | v52.58,20.07 52.39,20.25 Y1.4 | MAGNETOMETER.10 53.59,11.18 53.59,13.21 52.96,13.84 52.7,13.84 C10.1 52.7,13.34 v52.07,12.7 | MAGNETOMETER.3 v54.61,8.13 | R4.2 58.76,22.01 v58.17,22.61 R6.2 | S1.1 47.99,10.41 | v50.29,9.91 49.78,10.41 47.99,10.41 | S1.2 41.96,9.2 42.42,8.74 47.6,8.74 48.01,9.14 48.01,10.4 47.99,10.41 | AIRSPEED.2 60.96,25.06 60.96,26.16 60.33,26.8 C3.2 59.13,28.25 v58.93,28.45 58.08,29.3 R7.1 | R9.1 60.79,11.26 v60.71,11.18 | R8.2 48.64,8.38 v48.01,7.74 | BAROMETER.2 37.07,41.47 v37.08,41.45 | BAROMETER.5 32.89,39.37 v32,39.37 32,38.86 31.5,38.35 30.73,38.35 30.48,38.61 | 31.04,39.68 32.26,40.89 33.62,40.89 BAROMETER.6 | USB_COMM_MODE_FILTER.1 14.9,34.2 v15.49,34.8
  pour Route15: 0,44.45 76.2,44.45 76.2,6.35 0,6.35
5V  (1 unrouted)
  Top 0.203: 22.1,41.34 C7.1
  Top 0.305: POWER_MODULE.6 27.6,41.75 27.43,41.91 25.91,41.91 25.71,42.11 C6.1 22.86,42.93 22.23,42.29 C7.1 23.3,41.22 23.82,40.7 POWER_MODULE.1 | U$1.1 22.1,41.34
5V_IN
  Top 0.305: U$1.2 16.96,37.14 16.26,37.85 16.26,39.37 16,39.62 JST_CONNECTION.4
BOOT0  (1 unrouted)
  Top 0.203: 44.2,16.51 47.5,16.51 47.96,16.05 S1.3 | 43.43,23.11 43.43,17.27 44.2,16.51 | 44.2,16.51 42.67,16.51 41.96,15.8 S1.4 41.92,14.99 40.89,14.99 38.61,12.7 R5.1
CSB_ACCEL  (via drill 0.35)
  Top 0.203: IMU.14 54.24,39.99 52.83,41.4 v52.07,41.4 | v57.15,32.79 57.17,32.77 59.44,32.77 60.02,32.19 R12.2
  Bottom 0.203: v52.07,41.4 52.07,40.11 51.97,40.01 51.97,35.41 54.61,32.77 57.13,32.77 v57.15,32.79
CSB_GYRO  (via drill 0.35)
  Top 0.203: IMU.5 v61.1,38.49 | R13.2 v60.2,34.54
  Bottom 0.203: v61.1,38.49 61.1,37.34 61.1,37.22 61.1,36.34 61.09,36.33 61.09,35.44 v60.2,34.54
DN
  Top 0.203: USB_COMM_MODE_FILTER.2 14.45,34.57 13.97,35.05 10.41,35.05 9.57,35.89 JST_CONNECTION.3
DP
  Top 0.203: USB_COMM_MODE_FILTER.3 13.97,33.3 13.97,34.04 13.72,34.29 7.87,34.29 7.07,35.09 JST_CONNECTION.2
EXTI0  (via drill 0.35)
  Top 0.203: IMU.16 56.9,42.16 57.4,42.67 63.75,42.67 65.03,41.39 v65.03,40.38 | R14.2 63.17,32.51 v63.5,32.51
  Bottom 0.203: v63.5,32.51 65.03,34.04 v65.03,40.38
EXTI2  (via drill 0.35)
  Top 0.203: IMU.12 53.34,38.99 v53.16,39.17 | v47.5,42.67 R16.2
  Bottom 0.203: v53.16,39.17 53.16,39.44 53.59,39.88 53.59,42.16 52.58,43.18 48.01,43.18 v47.5,42.67
EXTI3
  Top 0.203: R17.2 72.9,16.51 74.38,17.99 AIRSPEED.5
EXTI4  (via drill 0.35)
  Top 0.203: MAGNETOMETER.7 55.11,12.18 v55.63,12.7 | R18.2 50.29,19.3 v50.55,19.05
  Bottom 0.203: v55.63,12.7 53.09,12.7 52.07,11.68 50.8,11.68 50.55,11.94 v50.55,19.05
GND  (via drill 0.35)  (45 unrouted)
  Top 0.203: 44.96,23.8 MICROCONTROLLER.63 44.91,21.94 C15.2 45.38,20.41 v45.47,20.32 | GPS.11 v22.85,15.25 v22.86,15.24 | GPS.10 17.14,9.77 v17.02,9.65 | v3.43,17.27 3.55,17.15 GPS.4 | GPS.20 9.54,27.04 v7.62,28.96 6.74,28.07 GPS.1 3.69,22.85 v3.43,23.11 | GPS.6 9.54,9.64 v9.65,9.52 | C18.2 31.75,26.42 | v29.97,28.19 29.72,27.94 C20.2 | MICROCONTROLLER.47 31.97,26.34 C18.2 | C16.2 46.32,37.5 | MICROCONTROLLER.31 38.35,35.38 38.35,36.57 37.45,37.46 C17.2 35.81,37.55 35.81,38.35 35.56,38.61 v32.77,38.61 | C22.2 32.04,34.08 v32,34.04 | v29.97,28.19 29.72,28.19 | C18.2 31.75,27.69 31.24,28.19 v29.97,28.19 | C8.2 25.65,36.83 v24.89,37.59 24.89,35.56 25.27,35.18 C9.2 | GPS.16 16.76,26.02 v16.76,28.96 | GPS.15 22.23,25.15 v23.11,25.15 | GPS.5 3.31,15.25 v3.3,15.24 | C21.2 v49.53,22.35 | MICROCONTROLLER.18 44.91,36.52 44.96,36.58 45.97,36.58 46.32,36.92 C16.2 | C16.2 47.12,37.72 v47.75,37.08 | C14.2 52.16,31.04 C19.1 | C19.1 v53.34,30.99 | MICROCONTROLLER.12 49.18,31.34 49.28,31.24 49.28,30.48 49.78,29.97 52.07,29.97 52.21,30.11 C19.1 | Y1.2 54.29,26.86 v54.36,26.92 | MAGNETOMETER.6 55.37,10.66 56.39,11.68 56.39,13.21 56.73,13.55 C13.2 57.28,14.61 v57.15,14.73 | v57.15,14.73 56.64,14.73 56.01,14.1 C11.2 55.44,13.53 55.12,13.21 54.86,13.21 54.61,12.95 MAGNETOMETER.8 | v57.15,14.73 57.15,15.49 56.9,15.75 C12.2 | C10.2 52.7,16.38 v52.83,16.51 | R5.2 v38.61,8.38 | v60.2,14.22 C23.2 | S2.3 65.04,8.64 v62.23,8.64 | S2.4 73.88,8.67 v73.91,8.64 | C3.1 61.27,29.41 61.72,28.96 61.72,26.88 AIRSPEED.1 | IMU.6 60.71,37.99 60.84,37.86 62.06,37.86 C4.2 62.61,37.21 v62.48,37.08 | v61.72,36.07 61.72,36.62 60.85,37.49 IMU.7
  Top 0.203: C5.2 v51.05,41.4 | BAROMETER.1 35.14,43.09 34.9,43.33 30.73,43.33 30.03,42.62 C1.2 | C2.2 31.11,41.47 BAROMETER.7 | D1.C 24.32,32.58 24.64,32.26 v26.67,32.26 | U2.13 v35.81,12.19 | USB_COMM_MODE_FILTER.8 14.9,31.84 14.99,31.75 16.51,31.75 v16.76,32 | USB_COMM_MODE_FILTER.5 13.55,31.84 v12.95,31.24
  Top 0.305: POWER_MODULE.2 23.5,39.75 | v22.35,38.61 23.5,39.75 | POWER_MODULE.7 26.16,38.86 | C6.2 v28.19,42.93 | 23.5,39.75 23.19,40.06 C7.2 | JST_CONNECTION.1 v4.57,35.56
  pour Route2: 0,44.45 76.2,44.45 76.2,6.35 0,6.35
GPIO_EXTI0  (via drill 0.35)
  Top 0.203: MICROCONTROLLER.14 47.31,32.26 46.11,32.26 45.72,31.87 v45.72,31.75 | R14.1 61.54,30.41 v61.21,30.73
  Bottom 0.203: v61.21,30.73 61.21,31.5 60.55,32.16 46.13,32.16 v45.72,31.75
GPIO_EXTI1  (via drill 0.35)
  Top 0.203: MICROCONTROLLER.15 45.8,32.84 v45.72,32.77 | v27.43,25.4 24.64,22.61 v24.64,21.84 | v13.46,7.87 13.35,7.87 L4.1
  Bottom 0.203: v45.72,32.77 43.69,30.73 30.73,30.73 27.43,27.43 v27.43,25.4 | v24.64,21.84 25.15,21.34 25.15,8.89 24.13,7.87 v13.46,7.87
GPIO_EXTI2  (1 unrouted)
  Top 0.203: MICROCONTROLLER.28 39.91,36.86 41.91,38.86 41.91,41.4 43.18,42.67 R16.1
GPIO_EXTI3  (via drill 0.35)
  Top 0.203: MICROCONTROLLER.11 46.08,30.84 45.72,30.48 v45.72,28.96 | R17.1 v63.5,16.51
  Bottom 0.203: v63.5,16.51 62.74,16.51 59.69,19.56 55.12,19.56 54.61,19.05 51.56,19.05 50.55,20.07 50.55,22.86 48.01,25.4 46.23,25.4 45.72,25.91 v45.72,28.96
GPIO_EXTI4  (via drill 0.35)  (1 unrouted)
  Top 0.203: MICROCONTROLLER.20 43.94,35.29 v43.94,33.78 | v33.02,31.75 33.02,30.48 v34.04,29.46 | v49.53,21.34 49.53,20.83 49.28,20.57 48.01,20.57 47.68,20.25 R18.1
  Bottom 0.203: v43.94,33.78 37.34,33.78 36.07,35.05 31.75,35.05 30.99,34.29 30.99,33.53 31.24,33.27 32,33.27 33.02,32.26 v33.02,31.75 | v34.04,29.46 35.05,28.45 42.42,28.45 v49.53,21.34
GPS_SAFEBOOT
  Top 0.203: GPS.8 13.34,10.03 14.99,8.38 22.1,8.38 JP6.1
I2C1_SCL  (1 unrouted)
  Top 0.203: 43.94,23.82 MICROCONTROLLER.61 43.91,18.32 45.21,17.02 49.28,17.02 51.31,14.99 51.31,8.47 R8.1 53.34,8.38 53.61,8.65 MAGNETOMETER.1
I2C1_SDA  (1 unrouted)
  Top 0.203: MAGNETOMETER.4 56.91,9.66 59.09,11.85 R9.2 59.09,16.34 57.66,17.78 44.96,17.78 44.41,18.33 MICROCONTROLLER.62
I2C2_SCL  (1 unrouted)
  Top 0.203: BAROMETER.4 37.8,40.17 38.93,39.04 R1.1 40.51,38.23 39.41,37.12 MICROCONTROLLER.29
I2C2_SDA  (via drill 0.35)  (1 unrouted)
  Top 0.203: v38.35,38.1 38.91,37.55 MICROCONTROLLER.30 | v38.93,39.94 38.86,40.01 38.86,41.4 | 38.86,41.4 R2.1 | 38.86,41.4 38.28,40.82 BAROMETER.3
  Bottom 0.203: v38.93,39.94 38.35,39.37 v38.35,38.1
I2C3_SCL  (1 unrouted)
  Top 0.203: MICROCONTROLLER.8 48.89,29.34 49.53,28.7 54.86,28.7 57.82,25.74 R6.1 59.69,24.22 59.69,20.57 60.92,19.34 AIRSPEED.4
I2C3_SDA  (1 unrouted)
  Top 0.203: MICROCONTROLLER.9 49.15,29.84 49.66,29.34 55.24,29.34 56.98,27.6 R7.2 58.25,27.6 60.2,25.65 60.2,22.61 60.96,21.84 AIRSPEED.3
IMU_INT2  (via drill 0.35)  (1 unrouted)
  Top 0.203: IMU.1 60.45,40.49 61.62,41.66 62.48,41.66 | 62.23,41.66 63.5,41.66 v64.26,40.89 64.26,36.92 R10.2
IMU_INT4  (via drill 0.35)
  Top 0.203: IMU.13 53.73,39.49 v52.84,40.38 | v61.47,33.53 61.89,33.95 R10.1
  Bottom 0.203: v52.84,40.38 52.32,39.86 52.32,35.81 54.61,33.53 v61.47,33.53
N$1
  Top 0.203: Y1.3 52.39,26.68 R11.1
N$2
  Top 0.203: GPS.7 11.44,9 L4.2
N$3  (via drill 0.35)
  Top 0.203: MICROCONTROLLER.40 37.98,29.84 v38.1,29.72 | v57.4,31.5 57.91,30.99 R12.1
  Bottom 0.203: v38.1,29.72 45.6,29.72 46.11,30.23 54.36,30.23 54.86,30.73 54.86,31.24 55.12,31.5 v57.4,31.5
N$4  (via drill 0.35)
  Top 0.203: MICROCONTROLLER.39 34.68,30.34 34.04,30.99 v34.04,31.5 | v52.07,34.29 52.32,34.54 R13.1
  Bottom 0.203: v34.04,31.5 42.93,31.5 46.74,35.31 49.78,35.31 50.8,34.29 v52.07,34.29
N$5
  Top 0.203: R3.1 25.34,33.53 D1.A
N$6  (3 unrouted)
N$7
  Top 0.203: MAGNETOMETER.5 55.59,10.16 C13.1
N$8  (3 unrouted)
N$9  (3 unrouted)
N$10  (4 unrouted)
NRST  (via drill 0.35)
  Top 0.203: MICROCONTROLLER.7 48.63,28.84 49.27,28.2 50.21,28.2 50.22,28.19 54.36,28.19 57.06,25.49 R4.1 | R4.1 56.9,21.5 | R4.1 57.2,21.2 57.2,19.26 58.17,18.29 | U2.4 37.79,14.68 38.23,15.12 v38.23,15.49 | S2.2 71.07,14.02 70.1,14.99 65.79,14.99 65.07,14.27 S2.1 63.28,13.17 61.98,14.48 61.98,16.51 61.13,17.36 C23.1 59.09,17.36 58.17,18.29 | 58.17,18.29 46.23,18.29 v45.72,18.8 | POWER_MODULE.3 23.82,38.8 23.11,38.1 23.11,32.51 24.13,31.5 v24.89,31.5 | GPS.18 13.34,28.58 14.35,29.59 21.97,29.59 23.88,27.69 v26.16,27.69
  Bottom 0.203: v45.72,18.8 41.53,18.8 v38.23,15.49 37.21,16.51 33.02,16.51 26.16,23.37 v26.16,27.69 26.16,30.99 25.65,31.5 v24.89,31.5
NRST_O
  Top 0.203: JP7.6 28.96,14.99 29.21,15.24 32.77,15.24 33.33,14.68 U2.9
OSC_IN
  Top 0.203: MICROCONTROLLER.5 50.06,27.84 R11.2
RX
  Top 0.203: GPS.14 22.85,20.95 L5.2
RX_O
  Top 0.203: JP7.4 27.69,10.92 27.18,11.43 27.18,14.22 28.7,15.75 33.27,15.75 33.94,15.08 U2.8
SPI1_MISO  (via drill 0.35)  (1 unrouted)
  Top 0.203: MICROCONTROLLER.22 42.91,39.35 44.2,40.64 46.99,40.64 v48.01,39.62 | IMU.15 55.73,41.04 54.36,42.42 v48.51,42.42 49.78,41.15 49.78,38.1 50.8,37.08 52.58,37.08 53.48,37.99 IMU.10
  Bottom 0.203: v48.01,39.62 48.01,41.91 v48.51,42.42
SPI1_MOSI  (1 unrouted)
  Top 0.203: MICROCONTROLLER.23 42.42,39.88 43.69,41.15 48.26,41.15 49.02,40.39 49.02,38.1 50.8,36.32 53.34,36.32 54.51,37.49 IMU.9
SPI1_SCK  (1 unrouted)
  Top 0.203: MICROCONTROLLER.21 43.41,39.09 44.2,39.88 46.23,39.88 51.05,35.05 55.37,35.05 56.9,36.58 IMU.8
SPI2_MISO  (1 unrouted)
SPI2_MOSI  (1 unrouted)
SPI2_SCK  (1 unrouted)
SWCLK  (via drill 0.35)
  Top 0.203: MICROCONTROLLER.49 37.91,22.16 v37.85,22.1 | U2.2 36.48,13.92 37.64,13.92 38.1,13.46 38.61,13.46 39.22,14.07 39.22,18.9 v39.37,19.05
  Bottom 0.203: v37.85,22.1 37.85,20.32 38.35,19.81 39.37,19.81 39.62,19.56 39.62,19.3 v39.37,19.05
SWCLK_O
  Top 0.203: U2.11 35.15,13.83 34.41,13.83 33.93,13.36 33.93,11.18 33.68,10.92 JP7.3
SWDIO  (via drill 0.35)
  Top 0.203: v35.05,18.54 38.1,18.54 38.86,17.78 38.86,14.22 38.61,13.97 38.35,13.97 38.05,14.28 U2.3 | MICROCONTROLLER.46 33.15,26.84 v32.77,27.23
  Bottom 0.203: v32.77,27.23 32.77,20.83 v35.05,18.54
SWDIO_O
  Top 0.203: U2.10 35.15,14.23 34.31,14.23 33.58,13.5 31.54,13.5 JP7.5
SWO
  Top 0.203: MICROCONTROLLER.55 40.91,17.27 40.89,17.27 39.62,16 39.62,13.72 38.86,12.95 38.1,12.95 37.58,13.48 U2.1
SWO_O
  Top 0.203: U2.12 35.17,13.46 34.54,13.46 34.29,13.21 34.29,8.89 33.78,8.38 JP7.1
TX
  Top 0.203: GPS.13 L2.2
TX_O
  Top 0.203: JP7.2 27.18,8.38 26.67,8.89 26.67,14.48 28.45,16.26 33.78,16.26 34.56,15.48 U2.7
USART1_RX  (via drill 0.35)  (1 unrouted)
  Top 0.203: U2.5 37.18,15.08 37.59,15.49 37.59,16.74 v37.87,17.02 | v42.67,19.81 42.67,20.7 43.05,21.07 43.05,21.6 42.91,21.74 MICROCONTROLLER.59
  Bottom 0.203: v42.67,19.81 42.16,19.3 41.15,19.3 38.61,16.76 38.12,16.76 v37.87,17.02
USART1_TX  (via drill 0.35)  (1 unrouted)
  Top 0.203: MICROCONTROLLER.58 42.41,21.35 v42.42,21.34 | U2.6 37.07,15.48 37.24,15.65 37.24,17.02 36.98,17.27 v36.07,17.27
  Bottom 0.203: v36.07,17.27 36.96,18.16 39.5,18.16 42.42,21.08 v42.42,21.34
USART3_RX
  Top 0.203: L5.1 25.79,20.83 26.3,20.32 38.35,20.32 39.41,21.37 MICROCONTROLLER.52
USART3_TX  (via drill 0.35)
  Top 0.203: MICROCONTROLLER.51 38.91,21.63 38.1,20.83 27.43,20.83 v27.18,21.08 | v26.16,18.03 25.15,19.05 L2.1
  Bottom 0.203: v27.18,21.08 27.18,18.54 26.67,18.03 v26.16,18.03
USB_DN
  Top 0.203: MICROCONTROLLER.44 34.39,27.84 31.24,30.99 14.73,30.99 14.48,31.24 14.48,32.24 USB_COMM_MODE_FILTER.7
USB_DP
  Top 0.203: USB_COMM_MODE_FILTER.6 14,30.96 14.48,30.48 30.48,30.48 33.62,27.34 MICROCONTROLLER.45
VREF
  Top 0.203: MICROCONTROLLER.13 49.11,31.84 49.28,32 49.28,32.51 49.66,32.89 C14.1 | C14.1 50.41,32.84 C19.2 | C14.1 50.46,33.87 50.18,34.15 L1.2